# EAGLE design Videopac SD cart 2.2 - alt (EAGLE 7.5.0)
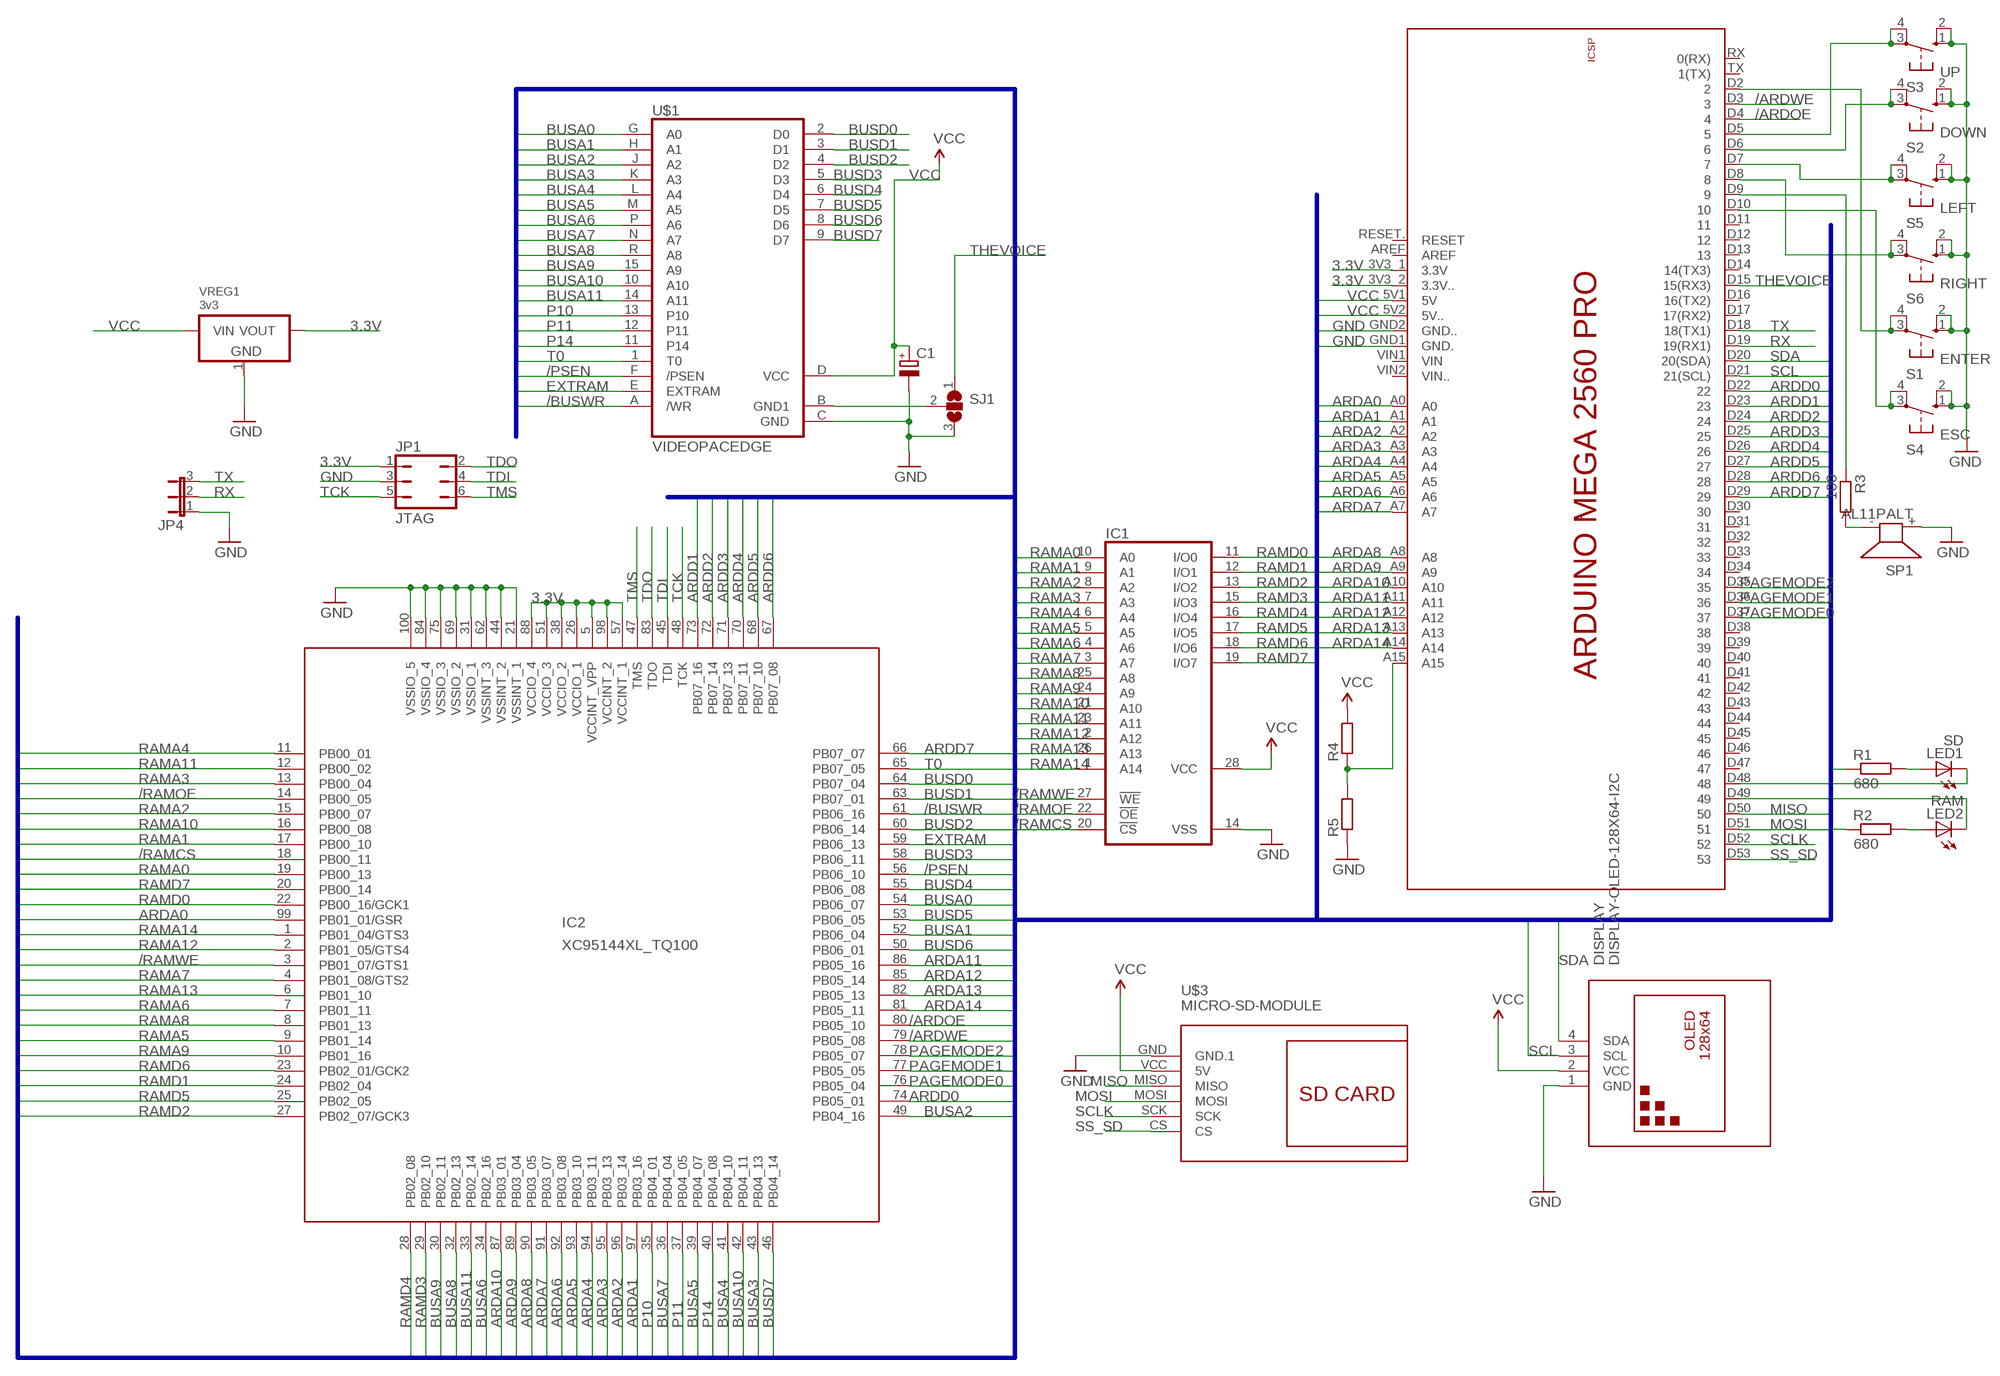
[diagram p0: schematic, sheet 1]

## Parts
C1  CPOL-EUE3.5-8  [E3,5-8]
DISPLAY  DISPLAY-OLED-128X64-I2C  [DISPLAY-OLED-128X64-I2C]
IC1  62256FPSOP28  [SOP28]
IC2  XC95144XL_TQ100  [XC-TQ100]
JP1  JTAG  JP3Q  [JP3Q]
JP4  JP2E  [JP2]
LED1  SD  LED3MM  [LED3MM]
LED2  RAM  LED3MM  [LED3MM]
R1  680  R-EU_0204/7  [0204/7]
R2  680  R-EU_0204/7  [0204/7]
R3  100  R-EU_0204/7  [0204/7]
R4  R-EU_0204/7  [0204/7]
R5  R-EU_0204/7  [0204/7]
S1  ENTER  10-XX  [B3F-10XX]
S2  DOWN  10-XX  [B3F-10XX]
S3  UP  10-XX  [B3F-10XX]
S4  ESC  10-XX  [B3F-10XX]
S5  LEFT  10-XX  [B3F-10XX]
S6  RIGHT  10-XX  [B3F-10XX]
SJ1  SJ2W  [SJ_2]
SP1  AL11PALT  [ALT]
U$1  VIDEOPACEDGE  [VIDEOPAC]
U$2  ARDUINO_MEGA2560_PRO  [ARDUINO_MEGA2560_PRO]
U$3  MICRO-SD-MODULE  [MICROSD-MODULE]
VREG1  3v3  LD1117-3.3SOT223  [SOT223]

## Nets
3.3V [3,3]: IC2.5(VCCINT_VPP) IC2.26(VCCIO_1) IC2.38(VCCIO_2) IC2.51(VCCIO_3) IC2.57(VCCINT_1) IC2.88(VCCIO_4) IC2.98(VCCINT_2) JP1.1 U$2.3V3_1(3.3V) U$2.3V3_2(3.3V..) VREG1.2(VOUT)
/ARDOE: IC2.80(PB05_10) U$2.D4
/ARDWE: IC2.79(PB05_08) U$2.D3
/BUSWR: IC2.61(PB06_16) U$1.A(/WR)
/PSEN: IC2.56(PB06_10) U$1.F(/PSEN)
/RAMCS: IC1.20(!CS) IC2.18(PB00_11)
/RAMOE: IC1.22(!OE) IC2.14(PB00_05)
/RAMWE: IC1.27(!WE) IC2.3(PB01_07/GTS1)
ARDA0: IC2.99(PB01_01/GSR) U$2.A0
ARDA1: IC2.97(PB03_16) U$2.A1
ARDA2: IC2.96(PB03_14) U$2.A2
ARDA3: IC2.95(PB03_13) U$2.A3
ARDA4: IC2.94(PB03_11) U$2.A4
ARDA5: IC2.93(PB03_10) U$2.A5
ARDA6: IC2.92(PB03_08) U$2.A6
ARDA7: IC2.91(PB03_07) U$2.A7
ARDA8: IC2.90(PB03_05) U$2.A8
ARDA9: IC2.89(PB03_04) U$2.A9
ARDA10: IC2.87(PB03_01) U$2.A10
ARDA11: IC2.86(PB05_16) U$2.A11
ARDA12: IC2.85(PB05_14) U$2.A12
ARDA13: IC2.82(PB05_13) U$2.A13
ARDA14: IC2.81(PB05_11) U$2.A14
ARDD0: IC2.74(PB05_01) U$2.D22
ARDD1: IC2.73(PB07_16) U$2.D23
ARDD2: IC2.72(PB07_14) U$2.D24
ARDD3: IC2.71(PB07_13) U$2.D25
ARDD4: IC2.70(PB07_11) U$2.D26
ARDD5: IC2.68(PB07_10) U$2.D27
ARDD6: IC2.67(PB07_08) U$2.D28
ARDD7: IC2.66(PB07_07) U$2.D29
BUSA0: IC2.54(PB06_07) U$1.G(A0)
BUSA1: IC2.52(PB06_04) U$1.H(A1)
BUSA2: IC2.49(PB04_16) U$1.J(A2)
BUSA3: IC2.43(PB04_13) U$1.K(A3)
BUSA4: IC2.41(PB04_10) U$1.L(A4)
BUSA5: IC2.39(PB04_07) U$1.M(A5)
BUSA6: IC2.34(PB02_16) U$1.P(A6)
BUSA7: IC2.36(PB04_04) U$1.N(A7)
BUSA8: IC2.32(PB02_13) U$1.R(A8)
BUSA9: IC2.30(PB02_11) U$1.15(A9)
BUSA10: IC2.42(PB04_11) U$1.10(A10)
BUSA11: IC2.33(PB02_14) U$1.14(A11)
BUSD0: IC2.64(PB07_04) U$1.2(D0)
BUSD1: IC2.63(PB07_01) U$1.3(D1)
BUSD2: IC2.60(PB06_14) U$1.4(D2)
BUSD3: IC2.58(PB06_11) U$1.5(D3)
BUSD4: IC2.55(PB06_08) U$1.6(D4)
BUSD5: IC2.53(PB06_05) U$1.7(D5)
BUSD6: IC2.50(PB06_01) U$1.8(D6)
BUSD7: IC2.46(PB04_14) U$1.9(D7)
BUTTON_A: S4.3(P) S4.4(P1) U$2.D10
BUTTON_B: S1.3(P) S1.4(P1) U$2.D2
BUTTON_DOWN: S2.3(P) S2.4(P1) U$2.D6
BUTTON_LEFT: S5.3(P) S5.4(P1) U$2.D7
BUTTON_RIGHT: S6.3(P) S6.4(P1) U$2.D8
BUTTON_UP: S3.3(P) S3.4(P1) U$2.D5
EXTRAM: IC2.59(PB06_13) U$1.E(EXTRAM)
GND: C1.- DISPLAY.1(GND) IC1.14(VSS) IC2.21(VSSINT_1) IC2.31(VSSIO_1) IC2.44(VSSINT_2) IC2.62(VSSINT_3) IC2.69(VSSIO_2) IC2.75(VSSIO_3) IC2.84(VSSIO_4) IC2.100(VSSIO_5) JP1.3 JP4.1 R5.1 S1.1(S) S1.2(S1) S2.1(S) S2.2(S1) S3.1(S) S3.2(S1) S4.1(S) S4.2(S1) S5.1(S) S5.2(S1) S6.1(S) S6.2(S1) SJ1.3 SP1.+ U$1.C(GND) U$2.GND1(GND.) U$2.GND2(GND..) U$3.GND(GND.1) VREG1.1(GND)
MISO: U$2.D50 U$3.MISO
MOSI: U$2.D51 U$3.MOSI
N$1: LED1.A R1.2
N$2: LED2.A R2.2
N$3: LED1.K(C) U$2.D48
N$4: LED2.K(C) U$2.D49
N$6: R3.1 U$2.D9
N$7: SJ1.2 U$1.B(GND1)
N$8: R4.1 R5.2 U$2.A15
N$10: R3.2 SP1.-
P10: IC2.35(PB04_01) U$1.13(P10)
P11: IC2.37(PB04_05) U$1.12(P11)
P14: IC2.40(PB04_08) U$1.11(P14)
PAGEMODE0: IC2.76(PB05_04) U$2.D37
PAGEMODE1: IC2.77(PB05_05) U$2.D36
PAGEMODE2: IC2.78(PB05_07) U$2.D35
RAMA0: IC1.10(A0) IC2.19(PB00_13)
RAMA1: IC1.9(A1) IC2.17(PB00_10)
RAMA2: IC1.8(A2) IC2.15(PB00_07)
RAMA3: IC1.7(A3) IC2.13(PB00_04)
RAMA4: IC1.6(A4) IC2.11(PB00_01)
RAMA5: IC1.5(A5) IC2.9(PB01_14)
RAMA6: IC1.4(A6) IC2.7(PB01_11)
RAMA7: IC1.3(A7) IC2.4(PB01_08/GTS2)
RAMA8: IC1.25(A8) IC2.8(PB01_13)
RAMA9: IC1.24(A9) IC2.10(PB01_16)
RAMA10: IC1.21(A10) IC2.16(PB00_08)
RAMA11: IC1.23(A11) IC2.12(PB00_02)
RAMA12: IC1.2(A12) IC2.2(PB01_05/GTS4)
RAMA13: IC1.26(A13) IC2.6(PB01_10)
RAMA14: IC1.1(A14) IC2.1(PB01_04/GTS3)
RAMD0: IC1.11(I/O0) IC2.22(PB00_16/GCK1)
RAMD1: IC1.12(I/O1) IC2.24(PB02_04)
RAMD2: IC1.13(I/O2) IC2.27(PB02_07/GCK3)
RAMD3: IC1.15(I/O3) IC2.29(PB02_10)
RAMD4: IC1.16(I/O4) IC2.28(PB02_08)
RAMD5: IC1.17(I/O5) IC2.25(PB02_05)
RAMD6: IC1.18(I/O6) IC2.23(PB02_01/GCK2)
RAMD7: IC1.19(I/O7) IC2.20(PB00_14)
RX: JP4.2 U$2.D19(19(RX1))
SCL: DISPLAY.3(SCL) U$2.D21(21(SCL))
SCLK: U$2.D52 U$3.SCK
SDA: DISPLAY.4(SDA) U$2.D20(20(SDA))
SS_SD: U$2.D53 U$3.CS
T0: IC2.65(PB07_05) U$1.1(T0)
TCK: IC2.48(TCK) JP1.5
TDI: IC2.45(TDI) JP1.4
TDO: IC2.83(TDO) JP1.2
THEVOICE: SJ1.1 U$2.D15(15(RX3))
TMS: IC2.47(TMS) JP1.6
TX: JP4.3 U$2.D18(18(TX1))
VCC: C1.+ DISPLAY.2(VCC) IC1.28(VCC) R1.1 R2.1 R4.2 U$1.D(VCC) U$2.5V1(5V) U$2.5V2(5V..) U$3.VCC(5V) VREG1.3(VIN)
Unconnected: U$2.+5V_ U$2.AREF U$2.D11 U$2.D12 U$2.D13 U$2.D14(14(TX3)) U$2.D16(16(TX2)) U$2.D17(17(RX2)) U$2.D30 U$2.D31 U$2.D32 U$2.D33 U$2.D34 U$2.D38 U$2.D39 U$2.D40 U$2.D41 U$2.D42 U$2.D43 U$2.D44 U$2.D45 U$2.D46 U$2.D47 U$2.GND__ U$2.MISO U$2.MOSI U$2.RESET.(RESET) U$2.RST(RESET.) U$2.RX(0(RX)) U$2.SCK U$2.TX(1(TX)) U$2.VIN1(VIN) U$2.VIN2(VIN..)

## Buses
RAMD[0..7],RAMA[0..14],BUSD[0..7],BUSA[0..11],P10,P11,P14,/PSEN,/BUSWR,ARDD[0..7],ARDA[0..14],/ARDWE,/ARDOE,/ARDCS,/RAMWE,/RAMOE,/RAMCS,TMS,TCK,TDO,TDI,MOSI,MISO,SCLK,SCL,SDA,T0,EXTRAM,RESET,VCC,GND,PAGEMODE[0..5]

## Library data of the parts
C1 = rcl:CPOL-EU: POLARIZED CAPACITOR, European symbol
DISPLAY = diy-modules:DISPLAY-OLED-128X64-I2C: 128x64 Dot Matrix OLED Module based on SSD1306 chip Variant with I2C interface More details available here: http://www.instructables.com/id/Monochrome-096-i2c-OLED-display-with-arduino-SSD13/ SSD1306 datasheet: https://cdn-shop.adafruit.com/datasheets/SSD1306.pdf Click here to find device on ebay.com <http://www.ebay.com/sch/oled+display+128x64+iic> Note: There are two variants: I2C and SPI. Search for the proper version.
IC1 = memory-hitachi:62256FP: MEMORY
IC2 = sdmapper_v1.8:XC95144XL_TQ100: xc95144xl_tq100 edit this description Auto generated by make-symbol-device-package-bsdl.ulp Rev. 34 Source: xc95144xl_tq100.bsd
JP1 = jumper:JP3Q: JUMPER
JP4 = jumper:JP2E: JUMPER
LED1 LED2 = adafruit:LED: LED OSRAM: - CHIPLED LG R971, LG N971, LY N971, LG Q971, LY Q971, LO R971, LY R971 LH N974, LH R974 LS Q976, LO Q976, LY Q976 LO Q996 - Hyper CHIPLED LW Q18S LB Q993, LB Q99A, LB R99A - SideLED LS A670, LO A670, LY A670, LG A670, LP A670 LB A673, LV A673, LT A673, LW A673 LH A674 LY A675 LS A676, LA A676, LO A676, LY A676, LW A676 LS A679, LY A679, LG A679 - Hyper Micro SIDELED® LS Y876, LA Y876, LO Y876, LY Y876 LT Y87S - SmartLED LW L88C, LW L88S LB L89C, LB L89S, LG L890 LS L89K, LO L89K, LY L89K LS L896, LA L896, LO L896, LY L896 - TOPLED LS T670, LO T670, LY T670, LG T670, LP T670 LSG T670, LSP T670, LSY T670, LOP T670, LYG T670 LG T671, LOG T671, LSG T671 LB T673, LV T673, LT T673, LW T673 LH T674 LS T676, LA T676, LO T676, LY T676, LB T676, LH T676, LSB T676, LW T676 LB T67C, LV T67C, LT T67C, LS T67K, LO T67K, LY T67K, LW E67C LS E67B, LA E67B, LO E67B, LY E67B, LB E67C, LV E67C, LT E67C LW T67C LS T679, LY T679, LG T679 LS T770, LO T770, LY T770, LG T770, LP T770 LB T773, LV T773, LT T773, LW T773 LH T774 LS E675, LA E675, LY E675, LS T675 LS T776, LA T776, LO T776, LY T776, LB T776 LHGB T686 LT T68C, LB T68C - Hyper Mini TOPLED® LB M676 - Mini TOPLED Santana® LG M470 LS M47K, LO M47K, LY M47K Source: http://www.osram.convergy.de/
R1-R5 = rcl:R-EU_: RESISTOR, European symbol
S1-S6 = switch-omron:10-XX: OMRON SWITCH; MPN: B3F-1000; OC_FARNELL: 176432; OC_NEWARK: 36M3542
SJ1 = jumper:SJ2W: SMD solder JUMPER
SP1 = buzzer:AL11P: SPEAKER Source: Buerklin
U$1 = BUSES:VIDEOPAC
U$2 = E14_Arduino_revC:ARDUINO_MEGA2560_PRO
U$3 = diy-modules:MICRO-SD-MODULE
VREG1 = dp_devices:LD1117-3.3

## Net classes
0 default: width 0.152 mm, drill 0.4 mm, clearance 0.152 mm
1 power: width 0.4 mm, clearance 0.178 mm to class 0, clearance 0.229 mm
2 3,3: width 0.2 mm, drill 0.5 mm, clearance 0.152 mm to class 0

## Board
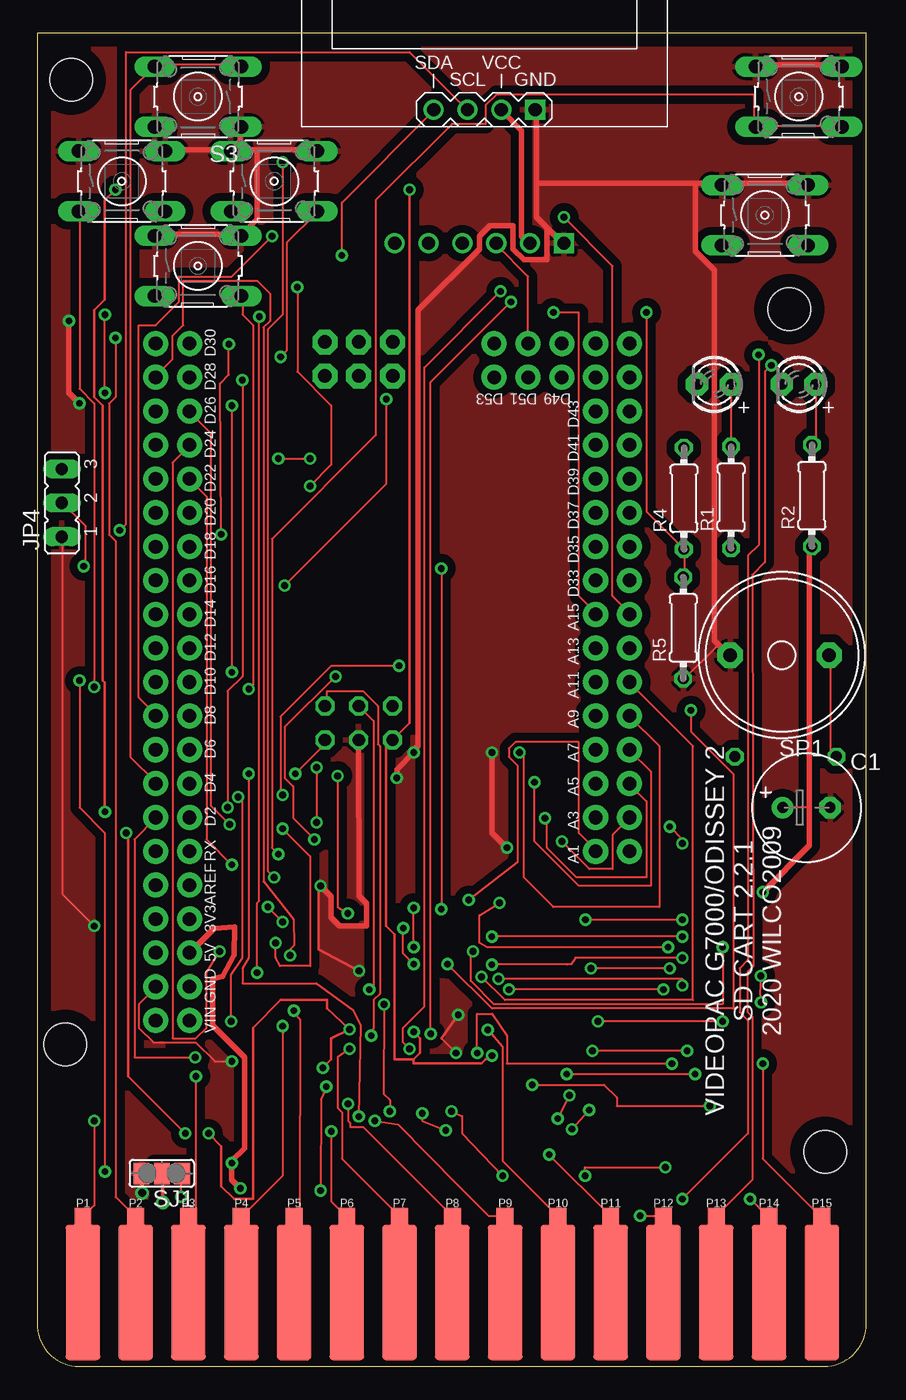
[diagram p1: board, top side]
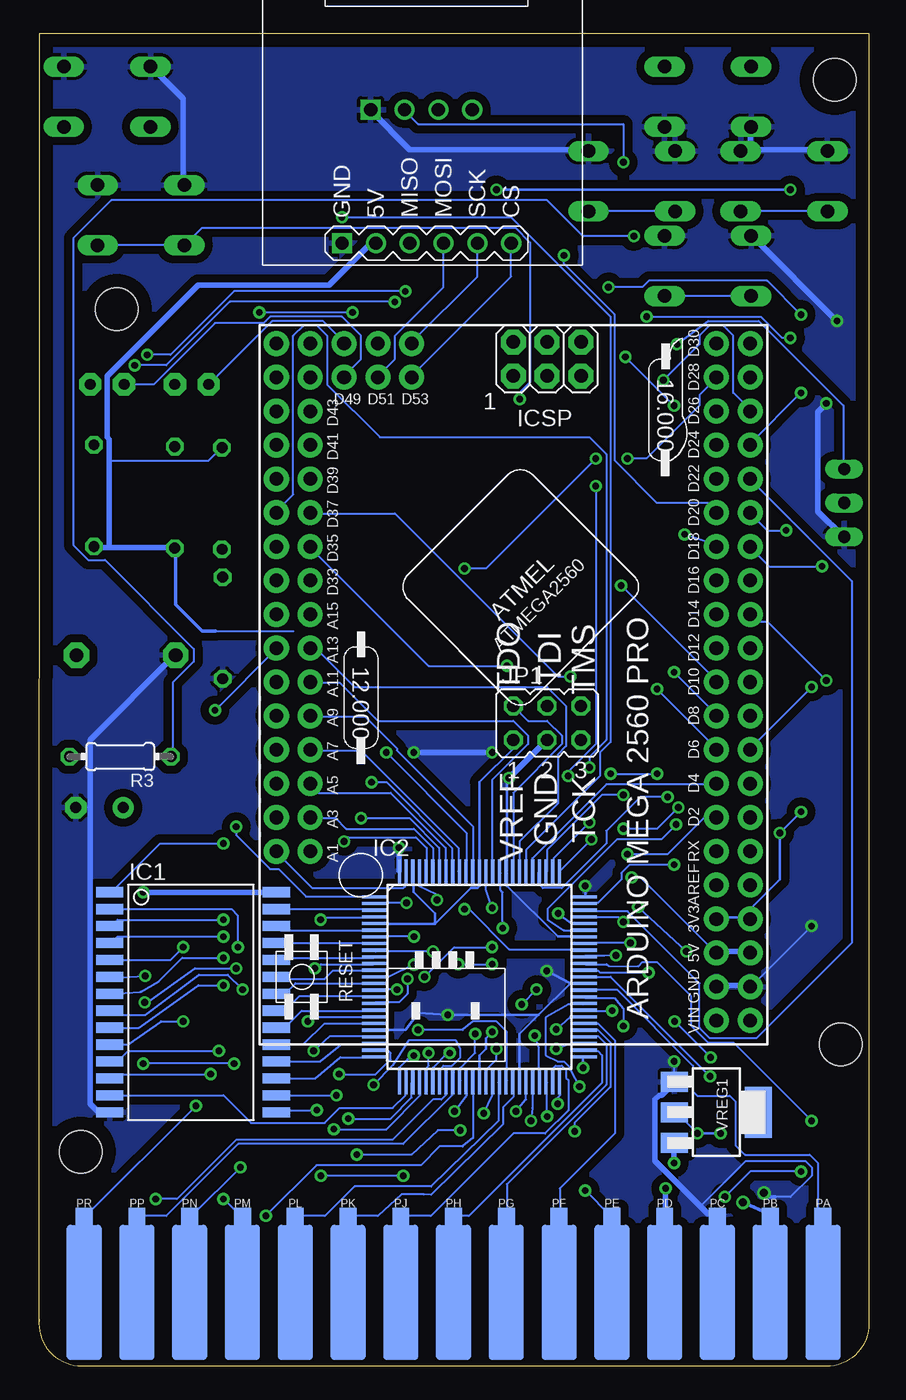
[diagram p2: board, bottom side, seen from below]

Size 62.25 x 100 mm. Coordinates in mm from the lower left corner, seen from the top.
Outline: 62.25,3.5 62.23,3.5 arc-90 59.36,0 2.88,0 arc-90 0.02,3.5 0.02,100 62.23,100 62.25,3.17 62.25,3.81
Copper layers (1*16): Top 0.035mm / dielectric 1.5mm / Bottom 0.035mm
Design rules "default *": minimum track width 6mil, minimum drill 20mil, track to track 6mil, track to pad 8mil, pad to pad 8mil, via to via 8mil, smd to smd 8mil, copper to edge 40mil, drill to drill 8mil, minimum pad ring 10mil, minimum via ring 8mil, stop-mask expansion 4mil, vias tented up to drill 0mil, thermal gap 10mil
Holes 3.2 mm at 2.13,24.13 59.15,16.1 2.56,96.52 56.45,79.31

### Footprints (pad centres in the part's own frame; a part is rotated, then mirrored left to right if it is on the bottom)
E3,5-8 = drill 0.813 pad 1.6: + -1.778,0 | drill 0.813 pad 1.6 octagon: - 1.778,0
DISPLAY-OLED-128X64-I2C = drill 1 square: 1 -3.81,12.7 | drill 1: 2 -1.27,12.7; 3 1.27,12.7; 4 3.81,12.7
SOP28 = smd 0.762 x 2.032: 1 -7.62,-6.16; 2 -6.35,-6.16; 3 -5.08,-6.16; 4 -3.81,-6.16; 5 -2.54,-6.16; 6 -1.27,-6.16; 7 0,-6.16; 8 1.27,-6.16; 9 2.54,-6.16; 10 3.81,-6.16; 11 5.08,-6.16; 12 6.35,-6.16; 13 7.62,-6.16; 14 8.89,-6.16; 15 8.89,6.35; 16 7.62,6.35; 17 6.35,6.35; 18 5.08,6.35; 19 3.81,6.35; 20 2.54,6.35; 21 1.27,6.35; 22 0,6.35; 23 -1.27,6.35; 24 -2.54,6.35; 25 -3.81,6.35; 26 -5.08,6.35; 27 -6.35,6.35; 28 -7.62,6.35
XC-TQ100 = smd 1.8 x 0.241: 1 -7.9,6; 2 -7.9,5.5; 3 -7.9,5; 4 -7.9,4.5; 5 -7.9,4; 6 -7.9,3.5; 7 -7.9,3; 8 -7.9,2.5; 9 -7.9,2; 10 -7.9,1.5; 11 -7.9,1; 12 -7.9,0.5; 13 -7.9,0; 14 -7.9,-0.5; 15 -7.9,-1; 16 -7.9,-1.5; 17 -7.9,-2; 18 -7.9,-2.5; 19 -7.9,-3; 20 -7.9,-3.5; 21 -7.9,-4; 22 -7.9,-4.5; 23 -7.9,-5; 24 -7.9,-5.5; 25 -7.9,-6; 51 7.9,-6; 52 7.9,-5.5; 53 7.9,-5; 54 7.9,-4.5; 55 7.9,-4; 56 7.9,-3.5; 57 7.9,-3; 58 7.9,-2.5; 59 7.9,-2; 60 7.9,-1.5; 61 7.9,-1; 62 7.9,-0.5; 63 7.9,0; 64 7.9,0.5; 65 7.9,1; 66 7.9,1.5; 67 7.9,2; 68 7.9,2.5; 69 7.9,3; 70 7.9,3.5; 71 7.9,4; 72 7.9,4.5; 73 7.9,5; 74 7.9,5.5; 75 7.9,6 | smd 0.241 x 1.8: 26 -6,-7.9; 27 -5.5,-7.9; 28 -5,-7.9; 29 -4.5,-7.9; 30 -4,-7.9; 31 -3.5,-7.9; 32 -3,-7.9; 33 -2.5,-7.9; 34 -2,-7.9; 35 -1.5,-7.9; 36 -1,-7.9; 37 -0.5,-7.9; 38 0,-7.9; 39 0.5,-7.9; 40 1,-7.9; 41 1.5,-7.9; 42 2,-7.9; 43 2.5,-7.9; 44 3,-7.9; 45 3.5,-7.9; 46 4,-7.9; 47 4.5,-7.9; 48 5,-7.9; 49 5.5,-7.9; 50 6,-7.9; 76 6,7.9; 77 5.5,7.9; 78 5,7.9; 79 4.5,7.9; 80 4,7.9; 81 3.5,7.9; 82 3,7.9; 83 2.5,7.9; 84 2,7.9; 85 1.5,7.9; 86 1,7.9; 87 0.5,7.9; 88 0,7.9; 89 -0.5,7.9; 90 -1,7.9; 91 -1.5,7.9; 92 -2,7.9; 93 -2.5,7.9; 94 -3,7.9; 95 -3.5,7.9; 96 -4,7.9; 97 -4.5,7.9; 98 -5,7.9; 99 -5.5,7.9; 100 -6,7.9
JP3Q = drill 0.914 octagon: 1 -2.54,-1.27; 2 -2.54,1.27; 3 0,-1.27; 4 0,1.27; 5 2.54,-1.27; 6 2.54,1.27
JP2 = drill 0.914 long: 1 -2.54,0; 2 0,0; 3 2.54,0
LED3MM = drill 0.813 pad 1.676 octagon: A -1.27,0; K 1.27,0
0204/7 = drill 0.813 octagon: 1 -3.81,0; 2 3.81,0
B3F-10XX = drill 1.016 long: 1 -3.251,2.261; 2 3.251,2.261; 3 -3.251,-2.261; 4 3.251,-2.261
SJ_2 = smd 1.168 x 1.6: 1 -1.524,0; 2 0,0; 3 1.524,0
ALT = drill 1.016 pad 1.905 octagon: + 3.873,0; - -3.556,0
VIDEOPAC = smd 1.27 x 1.27: 1 -27.683,6.167; 2 -23.723,6.167; 3 -19.763,6.167; 4 -15.803,6.167; 5 -11.843,6.167; 6 -7.883,6.167; 7 -3.923,6.167; 8 0.037,6.167; 9 3.997,6.167; 10 7.957,6.167; 11 11.917,6.167; 12 15.877,6.167; 13 19.837,6.167; 14 23.797,6.167; 15 27.757,6.167 | smd 1.27 x 1.27 bottom: A -27.683,6.167; B -23.723,6.167; C -19.763,6.167; D -15.803,6.167; E -11.843,6.167; F -7.883,6.167; G -3.923,6.167; H 0.037,6.167; J 3.997,6.167; K 7.957,6.167; L 11.917,6.167; M 15.877,6.167; N 19.837,6.167; P 23.797,6.167; R 27.757,6.167 | smd 2.6 x 10.16: P$1 -27.683,0.452; P$2 -23.723,0.452; P$3 -19.763,0.452; P$4 -15.803,0.452; P$5 -11.843,0.452; P$6 -7.883,0.452; P$7 -3.923,0.452; P$8 0.037,0.452; P$9 3.997,0.452; P$10 7.957,0.452; P$11 11.917,0.452; P$12 15.877,0.452; P$13 19.837,0.452; P$14 23.797,0.452; P$15 27.757,0.452 | smd 2.6 x 10.16 bottom: P$A -27.683,0.452; P$B -23.723,0.452; P$C -19.763,0.452; P$D -15.803,0.452; P$E -11.843,0.452; P$F -7.883,0.452; P$H -3.923,0.452; P$J 0.037,0.452; P$K 3.997,0.452; P$L 7.957,0.452; P$M 11.917,0.452; P$N 15.877,0.452; P$P 19.837,0.452; P$R 23.797,0.452; P$S 27.757,0.452
ARDUINO_MEGA2560_PRO = drill 1.016 pad 1.88: 3V3_1 9.42,3.81; 3V3_2 9.42,1.27; 5V1 6.88,3.81; 5V2 6.88,1.27; A0 14.5,36.83; A1 14.5,34.29; A2 17.04,36.83; A3 17.04,34.29; A4 19.58,36.83; A5 19.58,34.29; A6 22.12,36.83; A7 22.12,34.29; A8 24.66,36.83; A9 24.66,34.29; A10 27.2,36.83; A11 27.2,34.29; A12 29.74,36.83; A13 29.74,34.29; A14 32.28,36.83; A15 32.28,34.29; AREF 11.96,3.81; D2 17.04,3.81; D3 17.04,1.27; D4 19.58,3.81; D5 19.58,1.27; D6 22.12,3.81; D7 22.12,1.27; D8 24.66,3.81; D9 24.66,1.27; D10 27.2,3.81; D11 27.2,1.27; D12 29.74,3.81; D13 29.74,1.27; D14 32.28,3.81; D15 32.28,1.27; D16 34.82,3.81; D17 34.82,1.27; D18 37.36,3.81; D19 37.36,1.27; D20 39.9,3.81; D21 39.9,1.27; D22 42.44,3.81; D23 42.44,1.27; D24 44.98,3.81; D25 44.98,1.27; D26 47.52,3.81; D27 47.52,1.27; D28 50.06,3.81; D29 50.06,1.27; D30 52.6,3.81; D31 52.6,1.27; D32 34.82,36.83; D33 34.82,34.29; D34 37.36,36.83; D35 37.36,34.29; D36 39.9,36.83; D37 39.9,34.29; D38 42.44,36.83; D39 42.44,34.29; D40 44.98,36.83; D41 44.98,34.29; D42 47.52,36.83; D43 47.52,34.29; D44 50.06,36.83; D45 50.06,34.29; D46 52.6,36.83; D47 52.6,34.29; D48 52.6,31.75; D49 50.06,31.75; D50 52.6,29.21; D51 50.06,29.21; D52 52.6,26.67; D53 50.06,26.67; GND1 4.34,3.81; GND2 4.34,1.27; RST 11.96,1.27; RX 14.5,3.81; TX 14.5,1.27; VIN1 1.8,3.81; VIN2 1.8,1.27 | drill 1.016 pad 1.88 octagon: +5V_ 52.705,19.05; GND__ 52.705,13.97; MISO 50.165,19.05; MOSI 52.705,16.51; RESET. 50.165,13.97; SCK 50.165,16.51
MICROSD-MODULE = drill 1: CS 1.703,5.391; MISO 1.703,13.011; MOSI 1.703,10.471; SCK 1.703,7.931; VCC 1.703,15.551 | drill 1 square: GND 1.703,18.091
SOT223 = smd 1.5 x 2: 1 -2.3,-3.15; 2 0,-3.15; 3 2.3,-3.15 | smd 3.8 x 2: 4 0,3.15

### Placement (x,y rotation side)
C1  57.74,41.91 0 top
DISPLAY  33.58,106.97 180 top
IC1  50.82,27.94 270 bottom
IC2  29.23,29.21 0 bottom
JP1  24.15,48.26 0 bottom
JP4  1.86,64.77 90 top
LED1  50.82,73.66 180 top
LED2  57.17,73.66 180 top
R1  52.09,65.18 90 top
R2  58.15,65.31 90 top
R3  56.18,45.74 180 bottom
R4  48.55,65.1 90 top
R5  48.5,55.39 90 top
S1  57.17,95.25 0 top
S2  12.08,82.55 0 top
S3  12.08,95.25 180 top
S4  54.63,86.36 0 top
S5  6.37,88.9 0 top
S6  17.8,88.9 0 top
SJ1  9.37,14.46 180 top
SP1  55.9,53.34 180 top
U$1  31.13,5.08 0 top
U$2  7.64,24.13 90 bottom
U$3  21.45,82.55 90 bottom
VREG1  11.45,19.05 270 bottom

### Tracks (layer width: path | path; a pad name or v marks a point on that pad's centre or on a via)
3.3V  (via drill 0.51)
  Top 0.2: v21.45,22.38 22.08,23.02 22.08,24.61 v23.46,25.27 21.76,26.83 21.76,27.46 18.27,27.46 16.21,25.4 16.21,12.54 14.78,12.54 13.83,13.49 13.83,16.51 v12.87,17.46 | v6.68,40.01 6.84,39.85 6.84,21.75 v11.13,17.46 | v27.96,88.27 27.96,48.26 JP1.1 26.21,46.51 26.21,33.02 26.84,32.38 26.84,23.02 28.27,23.02 | v5.89,88.27 5.1,87.47 5.1,80.01 4.3,79.22 4.3,72.71 4.94,72.07 4.94,51.44 5.1,51.28 v5.1,41.59 | v28.27,25.08 28.75,24.61 28.75,23.5 28.27,23.02 | v34.15,23.3 33.67,23.02 33.35,22.7 28.27,22.7 28.27,23.02
  Bottom 0.2: JP1.1 26.69,46.35 29.23,43.81 IC2.88 29.23,36.04 29.38,35.88 29.86,35.88 32.56,33.18 | 8.91,33.66 11.45,33.66 U$2.3V3_1 | v21.45,22.38 21.45,23.18 IC2.51 | v23.46,25.27 22.4,26.19 21.45,26.19 IC2.57 | VREG1.2 14.46,19.05 v12.87,17.46 v11.13,17.46 | 8.91,33.66 8.91,34.29 6.68,36.51 v6.68,40.01 v5.1,41.59 | 8.91,33.66 U$2.3V3_2 | v5.89,88.27 v27.96,88.27 | IC2.38 29.23,23.34 28.75,23.81 28.75,24.61 v28.27,25.08 | v34.15,23.3 34.62,23.02 35.26,22.38 35.26,21.43 IC2.26 | 32.56,33.18 37,33.18 IC2.5 | 32.56,33.18 32.56,33.97 34.16,35.58 34.16,37.05 IC2.98
/ARDOE
  Bottom 0.152: IC2.80 25.26,37.15 25.26,38.1 19.7,43.66 11.45,43.66 U$2.D4
/ARDWE  (via drill 0.51)
  Top 0.152: v15.1,42.7 15.41,42.39 15.41,30.64 14.57,29.37 v14.57,25.88 | v11.87,23.18 7.32,23.18 7.32,39.53 8.91,41.12 U$2.D3
  Bottom 0.152: v15.1,42.7 17.16,42.7 19.7,40.16 19.7,39.21 23.03,35.88 24.46,35.88 24.78,36.2 24.78,36.99 IC2.79 | v11.87,23.18 v14.57,25.88
/BUSWR
  Bottom 0.152: U$1.A 3.51,11.27 3.83,11.27 3.83,15.24 4.44,15.86 9.3,15.86 10.02,16.57 10.02,19.86 10.45,20.29 12.87,20.29 13.19,20.64 13.19,22.54 18.91,28.26 21.29,28.26 IC2.61
/PSEN
  Bottom 0.152: U$1.F 23.19,11.27 23.19,13.34 19.07,17.46 19.07,24.45 20.34,25.72 21.29,25.72 IC2.56
/RAMCS
  Bottom 0.152: IC1.20 43.83,25.4 42.56,26.67 37.16,26.67 IC2.18
/RAMOE
  Bottom 0.152: IC1.22 43.83,27.94 43.04,28.73 37.16,28.73 IC2.14
/RAMWE
  Bottom 0.152: IC1.27 37.16,34.29 IC2.3
ARDA0
  Bottom 0.152: IC2.99 34.78,36.99 34.78,36.04 34.94,35.88 41.77,35.88 44.47,38.58 U$2.A0
ARDA1  (via drill 0.51)
  Top 0.152: v32.4,34.97 36.05,37.78 36.05,45.09 35.42,45.72 35.42,46.35 35.89,46.83 40.66,46.83 40.66,40.01 41.93,38.73 U$2.A1
  Bottom 0.152: v32.4,34.97 32.46,35.4 33.73,36.01 33.67,36.99 IC2.97
ARDA2  (via drill 0.51)
  Top 0.152: v39.39,39.37 41.45,37.31 43.2,37.31 43.2,39.85 44.47,41.12 U$2.A2
  Bottom 0.152: v39.39,39.37 39.07,39.69 33.99,39.69 33.19,38.89 33.19,37.15 IC2.96
ARDA3
  Bottom 0.152: IC2.95 32.72,37.15 32.72,38.89 34.15,40.32 39.23,40.32 40.02,41.12 41.93,41.12 U$2.A3
ARDA4  (via drill 0.51)
  Top 0.152: v38.12,41.12 38.27,40.96 38.27,38.89 40.5,36.67 45.74,36.67 45.74,42.39 44.47,43.66 U$2.A4
  Bottom 0.152: v38.12,41.12 34.46,41.12 32.24,38.89 32.24,37.15 IC2.94
ARDA5
  Bottom 0.152: IC2.93 31.77,37.15 31.77,38.89 35.89,43.02 41.29,43.02 41.93,43.66 U$2.A5
ARDA6  (via drill 0.51)
  Top 0.152: v37.32,43.81 37.32,39.37 40.66,36.04 46.05,36.04 46.05,44.61 44.47,46.2 U$2.A6
  Bottom 0.152: v37.32,43.81 36.21,43.81 31.29,38.89 31.29,37.15 IC2.92
ARDA7
  Bottom 0.152: IC2.91 30.81,37.15 30.81,38.89 38.12,46.2 41.93,46.2 U$2.A7
ARDA8  (via drill 0.51)
  Top 0.152: v36.21,46.04 36.53,45.72 36.53,36.67 38.75,34.45 46.69,34.45 46.69,46.51 44.47,48.74 U$2.A8
  Bottom 0.152: v36.21,46.04 30.18,40.01 30.18,37.15 IC2.90
ARDA9
  Bottom 0.152: IC2.89 29.7,37.15 29.7,40.48 35.42,46.2 35.42,46.35 37.8,48.74 41.93,48.74 U$2.A9
ARDA10  (via drill 0.51)
  Top 0.152: v28.27,31.43 v28.27,34.38 | v33.35,29.21 35.1,27.46 49.23,27.46 49.23,46.51 44.47,51.28 U$2.A10
  Bottom 0.152: v28.27,34.38 28.75,35.72 28.75,36.99 IC2.87 | v28.27,31.43 31.13,31.43 v33.35,29.21
ARDA11
  Bottom 0.152: IC2.86 28.27,37.15 28.27,43.97 25.57,46.67 25.57,47.31 26.69,48.42 36.85,48.42 39.7,51.28 41.93,51.28 U$2.A11
ARDA12  (via drill 0.51)
  Top 0.152: v27.48,32.86 27.48,30.96 v28.27,30.16 | v30.81,30.16 34.15,26.83 52.24,26.83 52.24,44.45 49.07,47.62 v49.07,49.21
  Bottom 0.152: v27.48,32.86 27.48,35.56 27.64,35.72 27.64,36.99 IC2.85 | v30.81,30.16 v28.27,30.16 | v49.07,49.21 44.47,53.82 U$2.A12
ARDA13
  Bottom 0.152: IC2.82 26.21,37.15 26.21,39.37 23.35,42.23 23.35,45.88 22.72,46.51 22.72,49.53 24.15,50.96 38.59,50.96 41.45,53.82 41.93,53.82 U$2.A13
ARDA14  (via drill 0.51)
  Top 0.152: v39.54,86.2 43.2,82.55 43.2,57.78 44.47,56.52 U$2.A14
  Bottom 0.152: v39.54,86.2 26.84,86.2 19.38,78.74 19.38,46.83 20.18,46.04 20.18,44.29 25.73,38.73 25.73,37.15 IC2.81
ARDD0  (via drill 0.51)
  Top 0.152: v14.62,37.62 12.72,39.53 12.72,65.25 11.45,66.52 U$2.D22
  Bottom 0.152: v14.62,37.62 17.95,37.62 18.59,36.99 18.59,36.51 20.34,34.77 21.29,34.77 IC2.74
ARDD1
  Bottom 0.152: IC2.73 21.29,34.13 18.11,34.13 12.72,28.73 12.72,25.4 11.92,24.61 8.43,24.61 1.29,31.75 1.29,58.9 8.91,66.52 U$2.D23
ARDD2  (via drill 0.51)
  Top 0.152: v17.32,34.45 v18.43,33.34 | v13.7,31.11 12.72,29.53 12.72,25.4 11.92,24.61 10.18,24.61 10.18,67.79 11.45,69.06 U$2.D24
  Bottom 0.152: v18.43,33.34 18.75,33.66 21.29,33.66 IC2.72 | v13.7,31.11 v17.32,34.45
ARDD3  (via drill 0.51)
  Top 0.152: v23.32,33.97 22.56,34.45 v22.56,44.29 | v20.49,66.04 22.08,67.63 22.08,72.07 19.54,74.61 v19.54,80.96 | v5.1,73.03 v5.1,78.9
  Bottom 0.152: v23.32,33.97 22.24,33.18 21.45,33.18 IC2.71 | v22.56,44.29 22.56,44.61 20.49,46.67 v20.49,66.04 | v19.54,80.96 17,80.96 16.53,81.44 7.64,81.44 v5.1,78.9 | v5.1,73.03 8.91,69.22 U$2.D25
ARDD4  (via drill 0.51)
  Top 0.152: v14.46,40.64 13.03,42.07 13.03,70.01 11.45,71.6 U$2.D26
  Bottom 0.152: v14.46,40.64 15.57,39.53 18.91,39.53 24.11,34.32 24.11,33.51 22.88,32.7 21.45,32.7 IC2.70
ARDD5  (via drill 0.51)
  Top 0.152: v17.91,31.75 17.91,30.64 18.24,30.02 20.49,30.02 20.49,38.26 v18.43,40.32 | v14.3,41.91 14.3,50.64 15.41,51.75 v15.41,73.98
  Bottom 0.152: v17.91,31.75 21.29,31.75 IC2.68 | v18.43,40.32 15.89,40.32 v14.3,41.91 | v15.41,73.98 12.72,76.68 12.72,77.31 11.92,78.11 10.97,78.11 10.18,77.31 10.18,73.03 8.91,71.75 U$2.D27
ARDD6  (via drill 0.51)
  Top 0.152: v30.34,59.85 v30.34,34.29 | v18.11,68.1 v20.49,68.1
  Bottom 0.152: v30.34,34.29 30.02,34.29 27,31.27 21.45,31.27 IC2.67 | v30.34,59.85 28.75,59.85 v20.49,68.1 | v18.11,68.1 16.68,68.1 12.72,72.07 12.72,72.87 11.45,74.14 U$2.D28
ARDD7  (via drill 0.51)
  Top 0.152: v18.99,30.81 18.99,31.26 19.3,31.57 19.27,33.51 17,36.35 17,77.95 17.48,78.42 17.48,80.49 16.53,81.44 10.97,81.44 10.97,78.11 10.18,77.31 10.18,75.56 8.91,74.3 U$2.D29
  Bottom 0.152: v18.99,30.81 19.86,30.8 21.29,30.8 IC2.66
BUSA0
  Bottom 0.152: U$1.G 27.16,11.27 27.16,13.65 19.7,21.11 19.7,24.13 20.34,24.77 21.29,24.77 IC2.54
BUSA1
  Bottom 0.152: U$1.H 31.13,11.27 30.02,11.27 20.02,21.27 20.02,23.34 20.34,23.65 21.29,23.65 IC2.52
BUSA2
  Bottom 0.152: U$1.J 35.1,11.27 32.88,11.27 26.69,17.46 24.3,17.46 22.56,19.21 22.56,21.48 22.72,21.64 22.72,22.23 23.03,22.54 23.51,22.54 23.67,22.38 23.67,21.43 IC2.49
BUSA3
  Bottom 0.152: U$1.K 39.07,11.27 36.85,11.27 35.08,12.89 33.4,12.89 32.88,12.86 27.45,18.14 27.45,19.43 26.69,20.19 26.69,21.27 IC2.43
BUSA4
  Bottom 0.152: U$1.L 43.04,11.27 40.81,11.27 38.59,13.49 32.85,13.49 27.8,18.4 27.8,21.27 IC2.41
BUSA5  (via drill 0.51)
  Top 0.152: v48.43,12.54 53.36,17.46 53.36,25.96 52.74,26.57 52.74,29.86 53.36,30.48 53.36,60.8 54.15,61.59 v54.15,75.88 | v34.78,80.64 29.07,74.93 29.07,26.99 27.48,25.4 27.48,24.29 v27.96,23.81
  Bottom 0.152: v48.43,12.54 47.16,11.27 U$1.M | v54.15,75.88 52.4,75.88 47.64,80.64 v34.78,80.64 | v27.96,23.81 27.96,23.02 28.75,22.23 28.75,21.43 IC2.39
BUSA6
  Bottom 0.152: U$1.P 54.78,11.27 52.72,11.27 47.32,16.67 34.94,16.67 31.29,20.32 31.29,21.27 IC2.34
BUSA7  (via drill 0.51)
  Top 0.152: v47.16,14.92 41.13,14.92 v41.13,14.29 | v34.94,14.29 31.89,17.48 31.89,18.75 v31.1,19.11
  Bottom 0.152: v47.16,14.92 50.82,11.27 U$1.N | v34.94,14.29 v41.13,14.29 | v31.1,19.11 30.18,20.32 30.18,21.27 IC2.36
BUSA8  (via drill 0.51)
  Top 0.152: v50.5,19.53 43.51,19.53 43.51,20.16 42.56,21.11 v37.16,21.11
  Bottom 0.152: v50.5,19.53 58.75,11.27 U$1.R | v37.16,21.11 35.73,22.57 34.99,23.75 34.56,24.43 30.99,24.43 30.65,23.81 30.65,23.18 31.29,22.54 31.92,22.54 32.24,22.23 32.24,21.43 IC2.32
BUSA9  (via drill 0.51)
  Top 0.152: v54.47,22.7 54.47,15.56 58.75,11.27 U$1.15 | v47.64,22.7 35.26,22.7 35.26,24.77 34.15,26.45 33.04,26.45 v33.04,23.5
  Bottom 0.152: v47.64,22.7 v54.47,22.7 | v33.04,23.5 33.04,22.54 33.19,22.38 33.19,21.43 IC2.30
BUSA10  (via drill 0.51)
  Top 0.152: v33.83,25.23 34.94,23.97 34.94,15.4 39.07,11.27 U$1.10
  Bottom 0.152: v33.83,25.23 30.5,25.23 29.7,25.88 27.96,25.88 27.16,25.08 27.16,21.43 IC2.42
BUSA11  (via drill 0.51)
  Top 0.152: v53.51,12.54 54.78,11.27 U$1.14
  Bottom 0.152: v53.51,12.54 51.93,12.54 47.48,16.99 35.73,16.99 32.72,20 32.08,20 31.77,20.32 31.77,21.27 IC2.33
BUSD0  (via drill 0.51)
  Top 0.152: v5.89,77.15 5.89,72.71 5.41,72.23 5.41,62.39 5.89,61.91 5.89,12.7 7.32,11.27 U$1.2 | v16.68,78.74 16.68,34.92 16.53,34.77 v16.53,29.53
  Bottom 0.152: v5.89,77.15 6.52,77.15 8.11,78.74 v16.68,78.74 | v16.53,29.53 20.18,29.53 20.34,29.69 21.29,29.69 IC2.64
BUSD1  (via drill 0.51)
  Top 0.152: v11.92,21.75 11.92,11.75 11.45,11.27 U$1.3
  Bottom 0.152: v11.92,21.75 19.38,29.21 IC2.63
BUSD2  (via drill 0.51)
  Top 0.152: v18.43,25.51 18.43,14.29 15.41,11.27 U$1.4
  Bottom 0.152: v18.43,25.51 18.43,26.84 18.45,26.86 19.11,27.62 21.29,27.62 IC2.60
BUSD3  (via drill 0.51)
  Top 0.152: v19.27,26.67 19.27,26.46 19.73,26 19.7,11.59 19.38,11.27 U$1.5
  Bottom 0.152: v19.27,26.67 21.29,26.67 IC2.58
BUSD4  (via drill 0.51)
  Top 0.152: v22.08,17.62 22.08,12.38 23.19,11.27 U$1.6
  Bottom 0.152: v22.08,17.62 22.08,18.26 19.38,20.95 19.38,24.29 20.34,25.24 21.29,25.24 IC2.55
BUSD5  (via drill 0.51)
  Top 0.152: v23.46,23.8 22.56,23.18 22.56,19.37 22.88,19.05 22.88,15.56 27.16,11.27 U$1.7
  Bottom 0.152: v23.46,23.8 22.56,24.13 21.45,24.13 IC2.53
BUSD6  (via drill 0.51)
  Top 0.152: v23.35,19.68 23.35,18.41 23.51,18.26 23.51,17.94 24.46,17.94 31.13,11.27 U$1.8
  Bottom 0.152: v23.35,19.68 23.35,20.16 23.19,20.32 23.19,21.27 IC2.50
BUSD7  (via drill 0.51)
  Top 0.152: v25.35,18.41 27.1,18.13 31.59,13.57 33.89,11.27 35.1,11.27 U$1.9
  Bottom 0.152: v25.35,18.41 25.26,19.37 25.26,21.27 IC2.46
BUTTON_A  (via drill 0.51)
  Top 0.152: v18.59,58.58 26.21,66.2 v26.21,72.55
  Bottom 0.152: S4.4 57.8,84.14 51.45,84.14 S4.3 51.29,84.14 50.02,85.41 26.53,85.41 25.42,84.3 25.42,73.82 26.21,73.03 v26.21,72.55 | v18.59,58.58 11.45,51.44 U$2.D10
BUTTON_B  (via drill 0.51)
  Top 0.152: S1.4 60.34,93.03 53.99,93.03 S1.3 53.83,93.03 53.83,95.41 34.46,95.41 33.67,94.61 33.67,93.19 31.13,93.19 25.42,87.47 25.42,69.85 17.64,62.07 17.64,38.89 v18.11,38.42
  Bottom 0.152: v18.11,38.42 15.1,38.42 12.4,41.12 11.45,41.12 U$2.D2
BUTTON_DOWN  (via drill 0.51)
  Top 0.152: v15.89,50.8 16.21,51.12 16.21,78.11 15.41,78.9 15.41,80.17 S2.4
  Bottom 0.152: S2.3 8.91,80.33 15.26,80.33 S2.4 | v15.89,50.8 11.45,46.35 U$2.D6
BUTTON_LEFT  (via drill 0.51)
  Top 0.152: v4.3,50.96 4.3,72.23 3.19,73.34 3.19,86.52 S5.3
  Bottom 0.152: S5.3 3.19,86.68 9.54,86.68 S5.4 | v4.3,50.96 8.91,46.35 U$2.D7
BUTTON_RIGHT  (via drill 0.51)
  Top 0.152: v14.62,72.07 v14.62,52.07 | v18.27,75.72 18.75,76.2 18.75,84.3 20.97,86.52 S6.4
  Bottom 0.152: S6.3 14.62,86.68 20.97,86.68 S6.4 | v14.62,52.07 11.45,48.9 U$2.D8 | v18.27,75.72 v14.62,72.07
BUTTON_UP
  Top 0.152: S3.3 15.26,97.63 8.91,97.63 S3.4 8.75,97.47 7,95.73 7,45.72 8.91,43.81 U$2.D5
EXTRAM  (via drill 0.51)
  Top 0.152: v21.72,20.97 21.3,20 v21.29,13.18
  Bottom 0.152: v21.29,13.18 19.38,11.27 U$1.E | v21.72,20.97 22.4,22.23 22.4,22.38 22.88,22.86 23.35,22.86 24.26,23.34 24.26,26.16 22.56,27.15 21.45,27.15 IC2.59
GND  (via drill 0.51, 0.6)
  Top 0.152: v4.3,33.02 1.92,35.4 1.92,62.23 JP4.1 | v14.62,22.86 13.35,22.86 11.92,24.29 8.75,24.29 7.64,25.4 7.64,27.15 8.91,28.42 U$2.GND2 | R5.1 48.59,51.59 50.97,53.98 50.97,54.13 51.05,54.21
  Top 0.2: v31.45,23.5 30.34,24.61 v31.61,26.35 | v21.29,36.04 21.13,35.88 21.13,31.27 v24.18,29.65
  Top 0.254: v7.87,13 7.87,14.43 SJ1.3
  Top 0.4: S2.1 8.91,84.93 15.26,84.93 S2.2 15.41,84.93 16.53,86.04 16.53,91.28 | S6.1 14.62,91.28 15.26,91.92 15.26,92.87 S3.1 | 16.53,91.28 14.78,91.28 S6.1 | 16.53,91.28 20.97,91.28 S6.2 | S5.2 9.7,91.28 14.46,91.28 S6.1 | v21.29,36.04 22.08,35.24 22.08,33.66 22.72,33.02 24.72,33.02 24.72,34.73 24.16,35.29 JP1.3 | v35.26,38.89 34.15,40.01 v34.15,46.04 | v27,44.13 27,44.77 v28.27,46.04 28.27,46.2 28.59,46.51 28.59,79.22 33.19,83.82 33.19,84.77 33.99,85.57 35.73,85.57 35.73,83.82 36.53,83.03 38.27,83.03 38.27,85.25 38.35,85.33 | 38.35,85.33 37.48,86.2 37.48,88.74 | 38.35,85.33 39.39,84.3 U$3.GND | 37.48,88.74 37.48,94.14 DISPLAY.1 | S4.2 57.8,88.74 51.45,88.74 S4.1 51.29,88.74 49.39,88.74 | S1.1 53.99,97.63 60.34,97.63 S1.2 | 49.39,88.74 37.48,88.74 | 49.39,88.74 49.39,83.66 50.82,82.23 50.82,54.45 51.05,54.21 51.93,53.34 SP1.+ | v3.19,72.23 2.4,73.03 v2.4,78.42
  Bottom 0.152: 11.45,29.21 U$2.GND1 | 12.64,11.99 9.22,15.4 4.78,15.4 4.3,14.92 4.3,14.29 5.89,12.7 7,12.7 7.02,12.72 | 58.44,41.91 C1.- | v4.3,33.02 8.75,28.57 U$2.GND2 | v14.62,22.86 14.62,21.43 VREG1.1
  Bottom 0.2: v21.29,36.04 21.29,35.24 IC2.75 | 35.26,37.15 IC2.100 | IC2.69 21.45,32.23 23.35,32.23 27.16,36.04 27.16,36.99 IC2.84 27.16,37.15 27.16,44.13 v27,44.13 | 22.4,28.73 24.78,26.35 | 24.78,26.35 26.21,24.92 26.21,21.43 IC2.44 | 22.4,28.73 21.45,28.73 IC2.62 | v31.45,23.5 31.61,23.5 32.72,22.38 32.72,21.43 IC2.31 | 24.78,26.35 v31.61,26.35 33.81,26.5 34.78,25.24 37,25.24 IC2.21 | 22.4,28.73 v24.18,29.65
  Bottom 0.254: 7.02,12.72 7.59,12.72 v7.87,13
  Bottom 0.4: 11.29,11.27 U$1.C 11.45,11.43 12.08,11.43 12.64,11.99 16.05,15.4 16.05,20 15.73,20.32 15.57,20.32 14.62,21.27 VREG1.1 | U$2.GND1 11.45,28.57 9.06,28.57 U$2.GND2 | IC1.14 57.8,19.05 58.44,19.68 58.44,41.91 58.44,46.99 52.09,53.34 SP1.+ | S5.1 3.19,91.28 9.54,91.28 S5.2 8.91,91.44 8.91,92.87 S3.2 | v35.26,38.89 35.26,37.15 | v28.27,46.04 v34.15,46.04 | JP1.3 v27,44.13 | S4.1 51.45,88.74 51.45,95.09 53.83,97.47 S1.1 | S6.2 21.13,91.28 34.46,91.28 37.32,94.14 DISPLAY.1 | v3.19,72.23 3.83,71.6 3.83,64.14 1.92,62.23 JP4.1 | v2.4,78.42 8.75,84.77 S2.1
  pour Top (isolate 0.61): 0.02,100.33 62.25,100.33 62.25,3.81 0.02,3.81
  pour Bottom (isolate 0.61): 0.02,100.33 62.25,100.33 62.25,3.81 0.02,3.81
MISO
  Top 0.152: U$2.D50 36.85,81.76 34.46,84.14 U$3.MISO
MOSI
  Bottom 0.152: U$3.MOSI 31.92,84.14 31.92,80.96 35.58,77.31 35.58,75.56 36.85,74.3 U$2.D51
N$1
  Top 0.152: LED1.A R1.2
N$2
  Top 0.152: LED2.A 58.44,69.37 58.28,69.22 R2.2
N$3
  Bottom 0.152: LED1.K 44.78,78.42 40.97,78.42 39.39,76.83 U$2.D48
N$4
  Bottom 0.152: LED2.K 53.67,73.66 49.07,78.26 45.42,78.26 44.94,78.74 39.54,78.74 38.12,77.31 38.12,75.56 39.39,74.3 U$2.D49
N$6  (via drill 0.51)
  Top 0.152: v17.64,84.77 14.62,81.76 10.65,81.76 10.65,79.85 8.91,78.11 7.64,78.11 7.64,50.16 8.91,48.9 U$2.D9
  Bottom 0.152: v17.64,84.77 21.45,84.77 24.15,87.47 56.85,87.47 59.71,84.61 59.71,61.59 58.59,60.48 57.32,60.48 50.66,53.82 50.66,52.86 52.24,51.28 52.24,45.88 R3.1
N$7  (via drill 0.6)
  Top 0.254: v9.45,12.29 9.45,14.53 SJ1.2
  Bottom 0.254: U$1.B 7.41,11.39 v9.45,12.29
N$8  (via drill 0.51)
  Top 0.152: R5.2 48.59,59.21 48.59,61.28 R4.1 48.43,61.44 45.74,64.14 v45.74,79.06 | v38.75,79.06 40.66,79.06 40.66,57.78 41.93,56.52 U$2.A15
  Bottom 0.152: v38.75,79.06 v45.74,79.06
N$10
  Top 0.152: R3.2 59.86,45.88 59.55,46.2 59.55,53.34 SP1.-
P10  (via drill 0.51)
  Top 0.152: v55.1,75.09 54.63,74.61 54.63,60.33 53.67,59.37 53.74,30 53.31,29.57 53.31,26.57 53.67,26.21 53.67,13.97 50.97,11.27 U$1.13 | v35.58,79.85 29.54,73.82 v29.54,24.92
  Bottom 0.152: v55.1,75.09 52.72,75.09 47.96,79.85 v35.58,79.85 | v29.54,24.92 29.54,23.5 30.65,22.38 30.65,21.43 IC2.35
P11  (via drill 0.51)
  Top 0.152: v45.26,11.27 47.01,11.27 U$1.12
  Bottom 0.152: v45.26,11.27 41.45,15.08 33.62,15.08 32.23,16.48 30.5,16.48 29.7,17.13 29.7,21.27 IC2.37
P14  (via drill 0.51)
  Top 0.152: v38.43,15.88 43.04,11.27 U$1.11 | v30.67,17.7 28.91,18.41 v28.91,18.97
  Bottom 0.152: v38.43,15.88 34.31,15.88 32.34,17.7 v30.67,17.7 | v28.91,18.97 28.27,20.32 28.27,21.27 IC2.40
PAGEMODE0  (via drill 0.51)
  Top 0.152: v20.81,39.53 19.22,41.12 19.22,43.5 18.59,44.13 18.59,47.94 v22.4,51.75
  Bottom 0.152: v20.81,39.53 23.19,37.15 IC2.76 | v22.4,51.75 23.35,51.75 35.58,63.98 41.93,63.98 U$2.D37
PAGEMODE1  (via drill 0.51)
  Top 0.152: v20.97,44.93 v20.97,40.8
  Bottom 0.152: v20.97,40.8 23.67,38.1 23.67,37.15 IC2.77 | v20.97,44.93 20.97,45.72 19.7,46.99 19.7,68.42 20.97,69.69 36.69,69.69 40.66,73.66 40.66,77.31 41.45,78.11 42.4,78.11 43.2,77.31 43.2,65.41 44.47,64.14 U$2.D36
PAGEMODE2  (via drill 0.51)
  Top 0.152: v18.43,42.86 18.27,43.02 18.27,48.74 22.08,52.55 v27.16,52.55
  Bottom 0.152: v18.43,42.86 20.02,42.86 24.15,38.73 24.15,37.15 IC2.78 | v27.16,52.55 33.04,52.55 41.93,61.44 U$2.D35
RAMA0  (via drill 0.51)
  Top 0.152: v51.45,25.88 v42.1,25.88
  Bottom 0.152: v42.1,25.88 41.93,26.19 37.16,26.19 IC2.19 | v51.45,25.88 53.12,25.88 55.58,24.13 IC1.10
RAMA1  (via drill 0.51)
  Top 0.152: v34.62,29.05 48.43,29.05 v48.43,28.57
  Bottom 0.152: v34.62,29.05 34.62,27.94 35.26,27.3 37,27.3 IC2.17 | v48.43,28.57 50.32,28.57 54.78,25.4 IC1.9
RAMA2  (via drill 0.51)
  Top 0.152: v47.01,28.26 v35.42,28.26
  Bottom 0.152: v35.42,28.26 37,28.26 IC2.15 | v47.01,28.26 48.12,29.37 50.29,29.37 54.31,26.35 56.53,26.35 56.85,26.67 IC1.8
RAMA3  (via drill 0.51)
  Top 0.152: v34.13,30.13 39.78,30.13 40.07,30.16 40.4,30.64 v48.43,30.64
  Bottom 0.152: IC2.13 36.05,29.21 v34.13,30.13 | v48.43,30.64 51.53,30.64 53.31,28.86 54.66,28.08 IC1.7
RAMA4  (via drill 0.51)
  Top 0.152: v47.48,29.84 v41.58,29.84 | v54.34,27.29 54.26,27.92 v54.31,29.29
  Bottom 0.152: v41.58,29.84 41.12,30.16 37.16,30.16 IC2.11 | v47.48,29.84 50.59,29.84 54.15,27.29 v54.34,27.29 | v54.31,29.29 56.09,29.16 56.85,29.21 IC1.6
RAMA5  (via drill 0.51)
  Top 0.152: v32.72,31.11 32.56,30.96 32.56,28.89 34.31,27.15 51.45,27.15 v51.45,31.43
  Bottom 0.152: v32.72,31.11 37,31.11 IC2.9 | v51.45,31.43 52.4,30.48 IC1.5
RAMA6  (via drill 0.51)
  Top 0.152: v48.43,32.23 v34.13,32.23
  Bottom 0.152: v34.13,32.23 37,32.23 IC2.7 | v48.43,32.23 56.37,32.23 56.85,31.75 IC1.4
RAMA7  (via drill 0.51)
  Top 0.152: v48.43,33.5 v41.15,33.5
  Bottom 0.152: v41.15,33.5 40.7,33.66 37.16,33.66 IC2.4 | v48.43,33.5 56.37,33.5 56.85,33.02 IC1.3
RAMA8
  Bottom 0.152: IC1.25 37.16,31.75 IC2.8
RAMA9
  Bottom 0.152: IC1.24 44.31,30.64 37.16,30.64 IC2.10
RAMA10
  Bottom 0.152: IC1.21 43.83,26.67 42.72,27.78 37.16,27.78 IC2.16
RAMA11
  Bottom 0.152: IC1.23 44.31,29.05 40.83,29.05 40.2,29.69 37.16,29.69 IC2.12
RAMA12  (via drill 0.51)
  Top 0.152: v34.7,34.77 33.19,33.83 33.19,31.77 33.81,31.43 v47.35,31.43
  Bottom 0.152: v34.7,34.77 37,34.77 IC2.2 | v47.35,31.43 47.35,33.81 47.83,34.29 IC1.2
RAMA13
  Bottom 0.152: IC1.26 44.15,32.7 37.16,32.7 IC2.6
RAMA14  (via drill 0.51)
  Top 0.152: v47.48,40.48 48.43,39.53 v48.43,39.21
  Bottom 0.152: v47.48,40.48 47.48,39.85 44.94,37.31 44.31,37.31 42.24,35.24 37.16,35.24 IC2.1 | v48.43,39.21 53.2,39.21 56.85,35.56 IC1.1
RAMD0  (via drill 0.51)
  Top 0.152: v48.78,23.65 v41.67,23.65
  Bottom 0.152: v41.67,23.65 40.42,24.77 37.16,24.77 IC2.22 | v48.78,23.65 55.58,23.65 56.37,22.86 IC1.11
RAMD1  (via drill 0.51)
  Top 0.152: v49.39,21.91 v39.75,21.91
  Bottom 0.152: v39.75,21.91 37,21.91 35.89,23.02 35.89,23.5 36.05,23.65 37,23.65 IC2.24 | v49.39,21.91 56.53,21.91 56.85,21.59 IC1.12
RAMD2
  Bottom 0.152: IC1.13 48.43,20.32 46.37,18.26 40.85,18.26 39.73,19.37 35.73,19.37 34.78,20.32 34.78,21.27 IC2.27
RAMD3  (via drill 0.51)
  Top 0.152: v41.43,19.21 v40.15,17.78
  Bottom 0.152: v40.15,17.78 36.21,17.78 33.67,20.32 33.67,21.27 IC2.29 | v41.43,19.21 44.31,19.21 IC1.15
RAMD4  (via drill 0.51)
  Top 0.152: v39.96,20.32 v39.07,18.57
  Bottom 0.152: v39.07,18.57 35.89,18.57 34.31,20.16 34.31,21.27 IC2.28 | IC1.16 v39.96,20.32
RAMD5
  Bottom 0.152: IC1.17 41.54,21.59 39.67,23.18 37.16,23.18 IC2.25
RAMD6
  Bottom 0.152: IC1.18 41.18,22.86 39.62,24.13 37.16,24.13 IC2.23
RAMD7
  Bottom 0.152: IC1.19 42.45,24.13 40.86,25.72 37.16,25.72 IC2.20
RX  (via drill 0.51)
  Top 0.152: v3.51,60.01 3.67,60.17 3.67,63.02 1.92,64.77 JP4.2
  Bottom 0.152: v3.51,60.01 7.48,60.01 8.91,61.44 U$2.D19
SCL  (via drill 0.51)
  Top 0.152: v6.21,62.71 6.68,63.18 6.68,98.58 27.96,98.58 32.24,94.3 DISPLAY.3
  Bottom 0.152: v6.21,62.71 7.64,62.71 8.91,63.98 U$2.D21
SCLK
  Bottom 0.152: U$3.SCK 29.38,84.14 29.38,81.76 34.31,76.83 U$2.D52
SDA  (via drill 0.51)
  Top 0.152: v22.88,83.34 22.88,87.31 29.7,94.14 DISPLAY.4
  Bottom 0.152: v22.88,83.34 22.88,82.71 19.07,78.9 19.07,67.94 15.89,64.77 12.08,64.77 11.45,64.14 U$2.D20
SS_SD
  Bottom 0.152: U$3.CS 26.84,84.14 26.84,81.76 34.31,74.3 U$2.D53
T0  (via drill 0.51)
  Top 0.152: v4.3,18.41 4.3,12.06 3.51,11.27 U$1.1
  Bottom 0.152: v4.3,18.41 10.18,24.29 12.08,24.29 13.35,25.56 13.35,27.78 15.89,30.32 16.99,30.32 17.3,30 19.51,30.04 19.67,30.16 21.29,30.16 IC2.65
TCK  (via drill 0.51)
  Top 0.152: v24.15,18.73 24.29,25.56 23.73,26.72 20.97,28.73 15.41,28.73 15.41,29.88 15.89,30.64 v15.89,44.45 | v19.38,44.45 21.61,46.67 JP1.5
  Bottom 0.152: v24.15,18.73 24.15,21.27 IC2.48 | v19.38,44.45 v15.89,44.45
TDI  (via drill 0.51)
  Top 0.152: v26.05,27.15 26.02,20.43 26.48,19.97 v26.48,19.11 | v24.94,28.26 25.26,28.57 25.26,48.42 JP1.4
  Bottom 0.152: v26.48,19.11 25.73,20 25.73,21.27 IC2.45 | v24.94,28.26 v26.05,27.15
TDO
  Bottom 0.152: JP1.2 25.57,48.42 24.15,48.42 23.03,47.31 23.03,46.67 26.69,43.02 26.69,37.15 IC2.83
THEVOICE  (via drill 0.51)
  Top 0.152: v10.81,12.7 10.81,13.97 SJ1.1 | v5.1,14.61 5.1,40.01 3.19,41.91 v3.19,51.44
  Bottom 0.152: v10.81,12.7 8.91,14.61 v5.1,14.61 | v3.19,51.44 7.64,55.88 8.91,55.88 U$2.D15
TMS  (via drill 0.51)
  Top 0.152: v25.08,24.8 25.26,25.4 25.26,27.46 25.73,27.94 25.73,46.51 25.57,46.67 25.57,49.53 24.46,50.64 21.76,50.64 21.76,49.69 JP1.6
  Bottom 0.152: v25.08,24.8 24.78,23.92 24.78,21.43 IC2.47
TX  (via drill 0.51)
  Top 0.152: v13.83,62.41 13.73,73.72 14.4,74.39 v14.4,76.68
  Bottom 0.152: v14.4,76.68 12.08,78.42 8.27,78.42 1.92,72.07 1.92,67.31 JP4.3 | v13.83,62.41 11.45,61.59 U$2.D18
VCC  (via drill 0.51)
  Top 0.152: v17.8,36.67 17.32,37.15 17.32,77.79 18.43,78.9 v18.43,90.33 | 57.96,41.91 C1.+
  Top 0.4: v15.26,13.34 14.62,13.97 v14.62,15.24 14.62,15.4 15.57,16.35 15.57,23.18 13.19,25.56 13.19,29.05 13.94,29.23 14.8,30.86 14.84,32.96 13.3,32.86 U$2.5V1 | 11.45,30.96 U$2.5V1 | U$2.5V1 | U$3.VCC 36.85,84.3 36.37,84.77 36.37,92.71 34.94,94.14 DISPLAY.2 | v54.47,35.56 57.96,39.05 57.96,41.91 57.96,61.28 58.12,61.44 R2.1
  Bottom 0.152: v17.8,36.67 17.16,36.67 11.6,31.11 U$2.5V1 | v18.43,90.33 18.43,93.19 33.83,93.19 34.78,94.14 DISPLAY.2 | 49.02,55.15 43.19,55.15 | 57.01,67.94 49.55,67.94 48.59,68.9 R4.2
  Bottom 0.254: 49.02,55.15 50.02,55.15 52.02,57.15 52.02,61.31 R1.1
  Bottom 0.4: v15.26,13.34 15.26,11.27 U$1.D | VREG1.3 14.62,16.67 v14.62,15.24 | U$2.5V2 8.91,31.11 11.45,31.11 U$2.5V1 | v54.47,35.56 IC1.28 | 57.01,61.44 58.12,61.44 R2.1 | 57.01,61.44 52.09,61.44 R1.1 | 57.01,61.44 57.01,67.94 57.01,69.53 57.17,69.69 57.17,74.3 50.34,81.12 40.5,81.12 37.48,84.14 37,84.14 U$3.VCC

### Text on the board
tPlace: VIDEOPAC G7000/ODISSEY 2 / SD CART 2.2.1 / 2020 WILCO2009
bNames: TMS | TDO | TDI | GND | VREF | TCK